# Altium schematic sheet Ignitors_SCH.SchDoc
size A
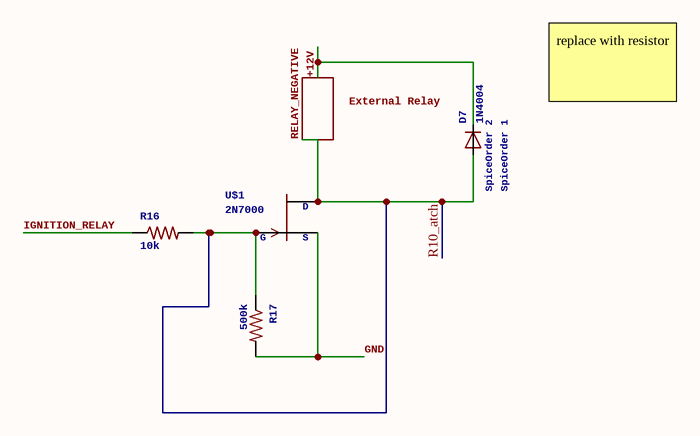
[diagram p0: Ignitors_SCH.SchDoc]

## Parts
D7  1N4004  SpiceOrder1: SpiceOrder 1  SpiceOrder2: SpiceOrder 2  [DO41-10]
R16  10k  [R0805]
R17  500k  [R0805]
U$1  2N7000  [SOT23]

## Nets
+12V: D7.C
GND: R17.2 U$1.2(S)
IGNITION_RELAY: R16.1
R10_atch: D7.A R16.2 R17.1 U$1.1(G) U$1.3(D)  [also labelled RELAY_NEGATIVE]

## Notes on the sheet
- (near D7) External Relay
- replace with resistor

## Library data of the parts
D7 = 1N4004: DIODEgeneral purpose rectifier, 1 A; GateName_1: 1; SymbolName_1: D; LibraryName: diode; DeviceSetName: 1N4004
R16 R17 = R-US_R0805: RESISTOR, American symbol; GateName_1: G$1; SymbolName_1: R-US; DeviceSetName: R-US_; DeviceName: R0805; LibraryName: rcl
U$1 = 2N7000: GateName_1: G$1; SymbolName_1: JFET-N; LibraryName: transistor-fet-extra; DeviceSetName: 2N7000; D: D; S: S; G: G